# Altium project BatteryCounterTX.PrjPcb
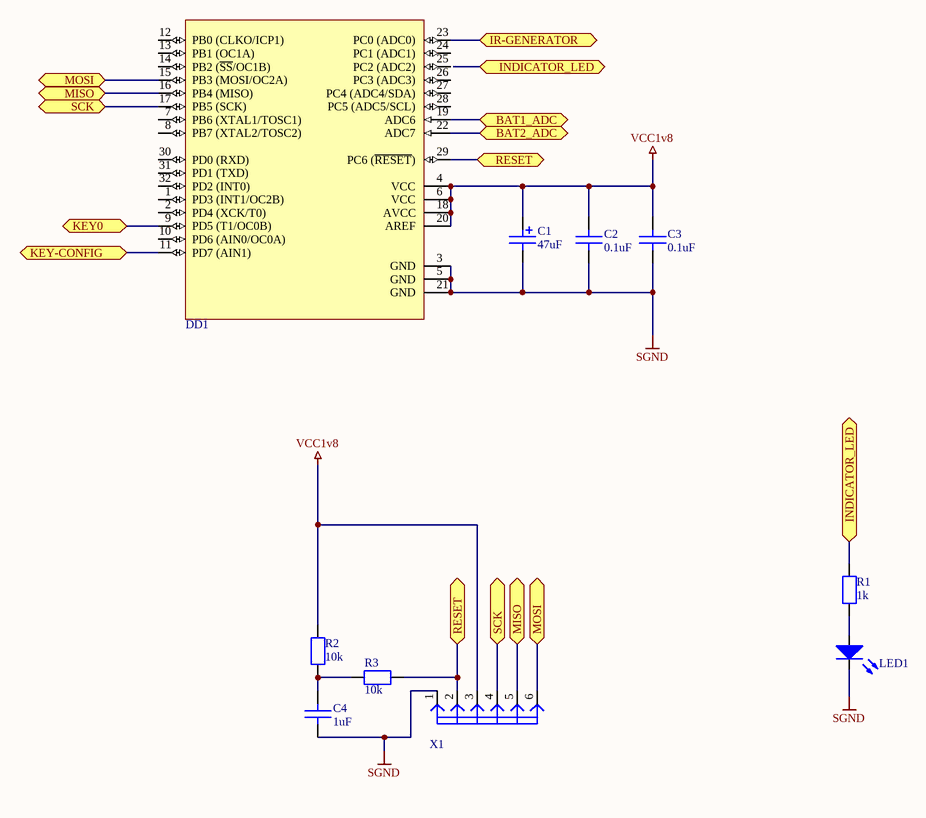
[diagram p0: Micro.SchDoc]
4 sheets, 46 parts. Net scope: global (net labels, ports and power ports of the same name join across sheets).
Sheets:
  Micro.SchDoc
  BattPower.SchDoc
  KeyBoard.SchDoc
  IRGenerator.SchDoc

## Sheet Micro.SchDoc
size A4

### Parts
C1  value 47uF  [TC2917]  (hidden comment: C47uF-10V-tant)
C2  value 0.1uF  [C0805]  (hidden comment: C0.1uF-50V)
C3  value 0.1uF  [C0805]  (hidden comment: C0.1uF-50V)
C4  value 1uF  [C0805]  (hidden comment: C1uF-50V)
DD1  ATmega328P  [32A_N]  (value not drawn)
LED1  LED-RED  [LED-3]  (value not drawn)
R1  value 1k  [R0805]  (hidden comment: R1k-5%)
R2  value 10k  [R0805]  (hidden comment: R10k-5%)
R3  value 10k  [R0805]  (hidden comment: R10k-5%)
X1  PLS-6  [PLS-6]  (value not drawn)

### Ports
BAT1_ADC, BAT2_ADC, INDICATOR_LED, IR-GENERATOR, KEY0, KEY-CONFIG, MISO, MOSI, RESET, SCK

### Nets
SGND: C1.2 C2.1 C3.1 C4.1 DD1.3(GND) DD1.5(GND) DD1.21(GND) LED1.2(K) X1.1
VCC1v8: C1.1 C2.2 C3.2 DD1.4(VCC) DD1.6(VCC) DD1.18(AVCC) DD1.20(AREF) R2.2 X1.3
NetC4_2: C4.2 R2.1 R3.1
NetDD1_9: DD1.9(PD5_(T1/OC0B)) ; port KEY0
NetDD1_11: DD1.11(PD7_(AIN1)) ; port KEY-CONFIG
NetDD1_15: DD1.15(PB3_(MOSI/OC2A)) X1.6 ; port MOSI
NetDD1_16: DD1.16(PB4_(MISO)) X1.5 ; port MISO
NetDD1_17: DD1.17(PB5_(SCK)) X1.4 ; port SCK
NetDD1_19: DD1.19(ADC6) ; port BAT1_ADC
NetDD1_22: DD1.22(ADC7) ; port BAT2_ADC
NetDD1_23: DD1.23(PC0_(ADC0)) ; port IR-GENERATOR
NetDD1_29: DD1.29(PC6_(~{RESET})) R3.2 X1.2 ; port RESET
NetLED1_1: LED1.1(A) R1.1
NetR1_2: R1.2 ; port INDICATOR_LED

Not connected (* = marked no-connect by the designer): DD1 1(PD3_(INT1/OC2B)) 2(PD4_(XCK/T0)) 7(PB6_(XTAL1/TOSC1)) 8(PB7_(XTAL2/TOSC2)) 10(PD6_(AIN0/OC0A)) 12(PB0_(CLKO/ICP1)) 13(PB1_(OC1A)) 14(PB2_(~{SS}/OC1B)) 24(PC1_(ADC1)) 25(PC2_(ADC2)) 26(PC3_(ADC3)) 27(PC4_(ADC4/SDA)) 28(PC5_(ADC5/SCL)) 30(PD0_(RXD)) 31(PD1_(TXD)) 32(PD2_(INT0))

### Library data of the parts
C1 = C47uF-10V-tant: Type: Конденсатор танталовый; Voltage: 10V; Name: C47uF-10V-tant
C2 C3 = C0.1uF-50V: Type: Конденсатор керамический; Voltage: 50V; Name: C0.1uF-50V
C4 = C1uF-50V: Type: Конденсатор керамический; Voltage: 50V; Name: C1uF-50V
DD1 = ATmega328P: 8-Bit AVR Microcontroller with 32K Bytes of In-System Programmable Flash Memory; Name: ATmega328P; Type: Микроконтроллер
LED1 = LED-RED: LED red; Type: Светодиод; Color: Красный; Name: LED-RED
R1 = R1k-5%: R-1k-5%; Precision: 5%; Type: Резистор; Name: R1k-5%
R2 R3 = R10k-5%: R-10k-5%; Precision: 5%; Type: Резистор; Name: R10k-5%
X1 = PLS-6: Name: PLS-6; Type: Линейка

## Sheet BattPower.SchDoc
size A4
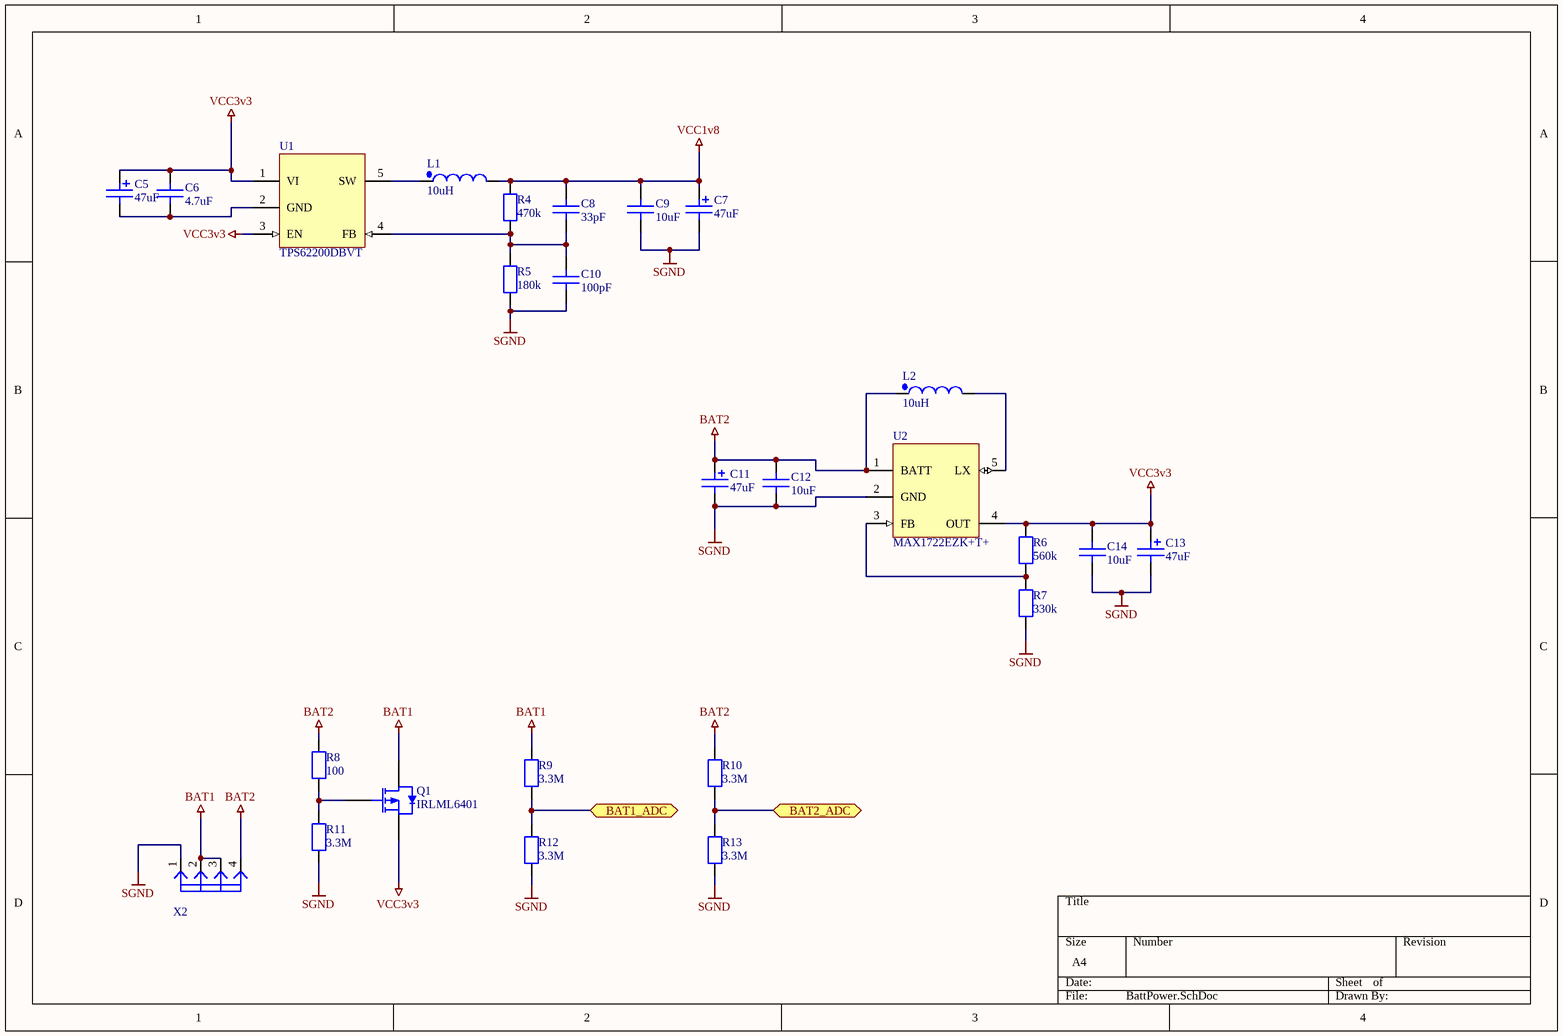
[diagram p1: BattPower.SchDoc]

### Parts
C5  value 47uF  [TC2917]  (hidden comment: C47uF-10V-tant)
C6  value 4.7uF  [C0805]  (hidden comment: C4.7uF-16V)
C7  value 47uF  [TC2917]  (hidden comment: C47uF-10V-tant)
C8  value 33pF  [C0805]  (hidden comment: C33pF-50V)
C9  value 10uF  [C0805]  (hidden comment: C10uF-16V)
C10  value 100pF  [C0805]  (hidden comment: C100pF-50V)
C11  value 47uF  [TC2917]  (hidden comment: C47uF-10V-tant)
C12  value 10uF  [C0805]  (hidden comment: C10uF-16V)
C13  value 47uF  [TC2917]  (hidden comment: C47uF-10V-tant)
C14  value 10uF  [C0805]  (hidden comment: C10uF-16V)
L1  value 10uH  [CD54-CDRH4D]  (hidden comment: CD54)
L2  value 10uH  [CD54-CDRH4D]  (hidden comment: CD54)
Q1  IRLML6401  [SOT23_N]
R4  value 470k  [R0805]  (hidden comment: R470k-1%)
R5  value 180k  [R0805]  (hidden comment: R180k-1%)
R6  value 560k  [R0805]  (hidden comment: R560k-1%)
R7  value 330k  [R0805]  (hidden comment: R330k-1%)
R8  value 100  [R0805]  (hidden comment: R100-5%)
R9  value 3.3M  [R0805]  (hidden comment: R3.3M-5%)
R10  value 3.3M  [R0805]  (hidden comment: R3.3M-5%)
R11  value 3.3M  [R0805]  (hidden comment: R3.3M-5%)
R12  value 3.3M  [R0805]  (hidden comment: R3.3M-5%)
R13  value 3.3M  [R0805]  (hidden comment: R3.3M-5%)
U1  TPS62200DBVT  [5ST1_N]
U2  MAX1722EZK+T+  [5ST1_N]
X2  PLS-4  [PLS-4]  (value not drawn)

### Ports
BAT1_ADC, BAT2_ADC

### Nets
BAT1: Q1.3(D) R9.2 X2.2 X2.3
BAT2: C11.1 C12.2 L2.1 R8.2 R10.2 U2.1(BATT) X2.4
SGND: C7.2 C9.1 C10.1 C11.2 C12.1 C13.2 C14.1 R5.1 R7.1 R11.1 R12.1 R13.1 U2.2(GND) X2.1
VCC1v8: C7.1 C8.2 C9.2 L1.2 R4.2
VCC3v3: C5.1 C6.2 C13.1 C14.2 Q1.2(S) R6.2 U1.1(VI) U1.3(EN) U2.4(OUT)
NetC5_2: C5.2 C6.1 U1.2(GND)
NetC8_1: C8.1 C10.2 R4.1 R5.2 U1.4(FB)
NetDD1_19: R9.1 R12.2 ; port BAT1_ADC
NetDD1_22: R10.1 R13.2 ; port BAT2_ADC
NetL1_1: L1.1 U1.5(SW)
NetL2_2: L2.2 U2.5(LX)
NetQ1_1: Q1.1(G) R8.1 R11.2
NetR6_1: R6.1 R7.2 U2.3(FB)

### Library data of the parts
C5 C7 C11 C13 = C47uF-10V-tant: as C1 on sheet Micro; Name: C47uF-10V-tant
C6 = C4.7uF-16V: Type: Конденсатор керамический; Voltage: 16V; Name: C4.7uF-16V
C8 = C33pF-50V: Type: Конденсатор керамический; Voltage: 50V; Name: C33pF-50V
C9 C12 C14 = C10uF-16V: Type: Конденсатор керамический; Voltage: 16V; Name: C10uF-16V
C10 = C100pF-50V: Type: Конденсатор керамический; Voltage: 50V; Name: C100pF-50V
L1 L2 = CD54NP-100M: Inductor with Winding Polarity Marking; Current: 1.44A; Type: Дроссель; Name: CD54
Q1 = IRLML6401: P-Channel Power MOSFET; Type: MOSFET P-канал; Vds: 12V; Id: 4.3A; Vgs: 0.4-0.95V; Name: IRLML6401
R4 = R470k-1%: Precision: 1%; Type: Резистор; Name: R470k-1%
R5 = R180k-1%: Precision: 1%; Type: Резистор; Name: R180k-1%
R6 = R560k-1%: Precision: 1%; Type: Резистор; Name: R560k-1%
R7 = R330k-1%: Precision: 1%; Type: Резистор; Name: R330k-1%
R8 = R100-5%: R-100-5%; Precision: 5%; Type: Резистор; Name: R100-5%
R9-R13 = R3.3M-5%: Precision: 5%; Type: Резистор; Name: R3.3M-5%
U1 = TPS62200DBVT: High efficiency step-down DC-DC convertor, 5-pin SOT23; Name: TPS62200DBVT; Type: DC-DC конвертор понижающий
U2 = MAX1722EZK+T+: High efficiency step-down DC-DC convertor, 5-pin SOT23; Name: MAX1722EZK+T+; Type: DC-DC конвертор повышающий
X2 = PLS-4: Name: PLS-4; Type: Линейка

## Sheet KeyBoard.SchDoc
size A4
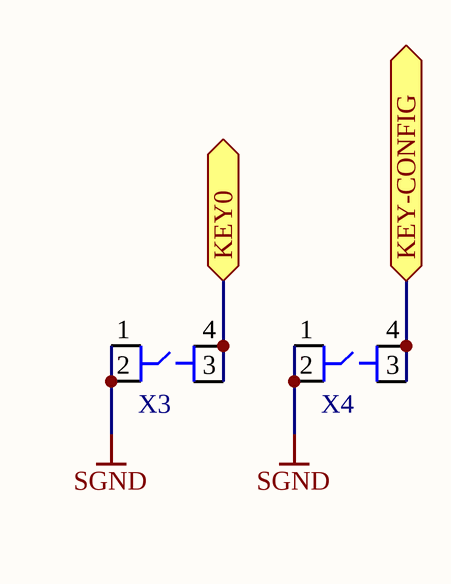
[diagram p2: KeyBoard.SchDoc]

### Parts
X3  TACT0606  [TACT0606]  (value not drawn)
X4  TACT0606  [TACT0606]  (value not drawn)

### Ports
KEY0, KEY-CONFIG

### Nets
SGND: X3.1 X3.2 X4.1 X4.2
NetDD1_9: X3.3 X3.4 ; port KEY0
NetDD1_11: X4.3 X4.4 ; port KEY-CONFIG

### Library data of the parts
X3 X4 = TACT0606: Tact switch 6x6mm; Name: TACT0606; Type: Кнопка

## Sheet IRGenerator.SchDoc
size A4
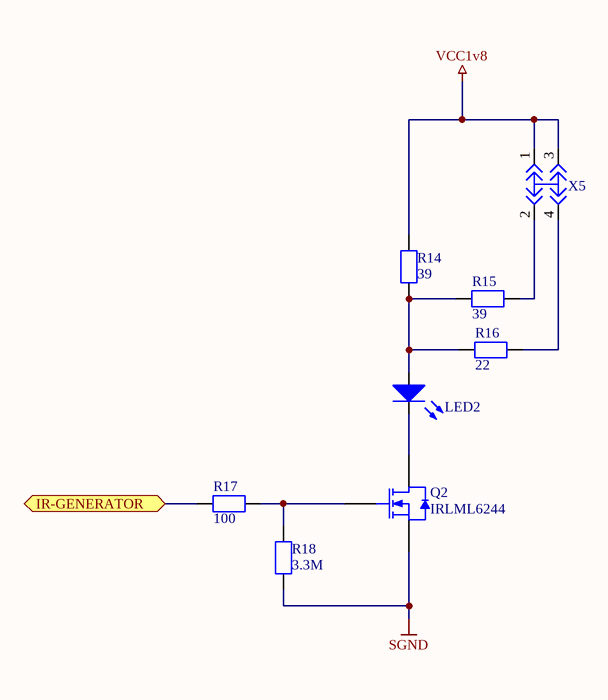
[diagram p3: IRGenerator.SchDoc]

### Parts
LED2  L53F3C  [LED-5-SHORT-LEGS]  (value not drawn)
Q2  IRLML6244  [SOT23_N]
R14  value 39  [R1206]  (hidden comment: R39-5%)
R15  value 39  [R1206]  (hidden comment: R39-5%)
R16  value 22  [R0805]  (hidden comment: R22-5%)
R17  value 100  [R0805]  (hidden comment: R100-5%)
R18  value 3.3M  [R0805]  (hidden comment: R3.3M-5%)
X5  JUMPER-PLD-POWER-0-1-2  [PLD-POWER-0-1-2]  (value not drawn)

### Ports
IR-GENERATOR

### Nets
SGND: Q2.2(S) R18.2
VCC1v8: R14.2 X5.1 X5.3
NetDD1_23: R17.1 ; port IR-GENERATOR
NetLED2_1: LED2.1(A) R14.1 R15.2 R16.1
NetLED2_2: LED2.2(K) Q2.3(D)
NetQ2_1: Q2.1(G) R17.2 R18.1
NetR15_1: R15.1 X5.2
NetR16_2: R16.2 X5.4

### Library data of the parts
LED2 = L53F3C: IR LED; Type: Светодиод; Color: IR; Name: L53F3C
Q2 = IRLML6244: N-Channel Power MOSFET; Type: MOSFET N-канал; Id: 6.3A; Vgs: 0.5-11V; Vds: 20V; Name: IRLML6244
R14 R15 = R39-5%: Precision: 5%; Type: Резистор; Name: R39-5%
R16 = R22-5%: Precision: 5%; Type: Резистор; Name: R22-5%
R17 = R100-5%: R-100-5%; Precision: 5%; Type: Резистор; Name: R100-5%
R18 = R3.3M-5%: Precision: 5%; Type: Резистор; Name: R3.3M-5%
X5 = JUMPER-PLD-POWER-0-1-2: Name: JUMPER-PLD-POWER-0-1-2; Type: Линейка джамперов

## Nets that join several sheets
SGND: Micro (9 pins), BattPower (14 pins), KeyBoard (X3.1 X3.2 X4.1 X4.2), IRGenerator (Q2.2 R18.2)
VCC1v8: Micro (9 pins), BattPower (5 pins), IRGenerator (R14.2 X5.1 X5.3)
NetDD1_9: Micro (DD1.9), KeyBoard (X3.3 X3.4)
NetDD1_11: Micro (DD1.11), KeyBoard (X4.3 X4.4)
NetDD1_19: Micro (DD1.19), BattPower (R9.1 R12.2)
NetDD1_22: Micro (DD1.22), BattPower (R10.1 R13.2)
NetDD1_23: Micro (DD1.23), IRGenerator (R17.1)